# Altium schematic sheet 6 half bridge.SchDoc
size A4; SheetNumber: 6; SheetTotal: 6
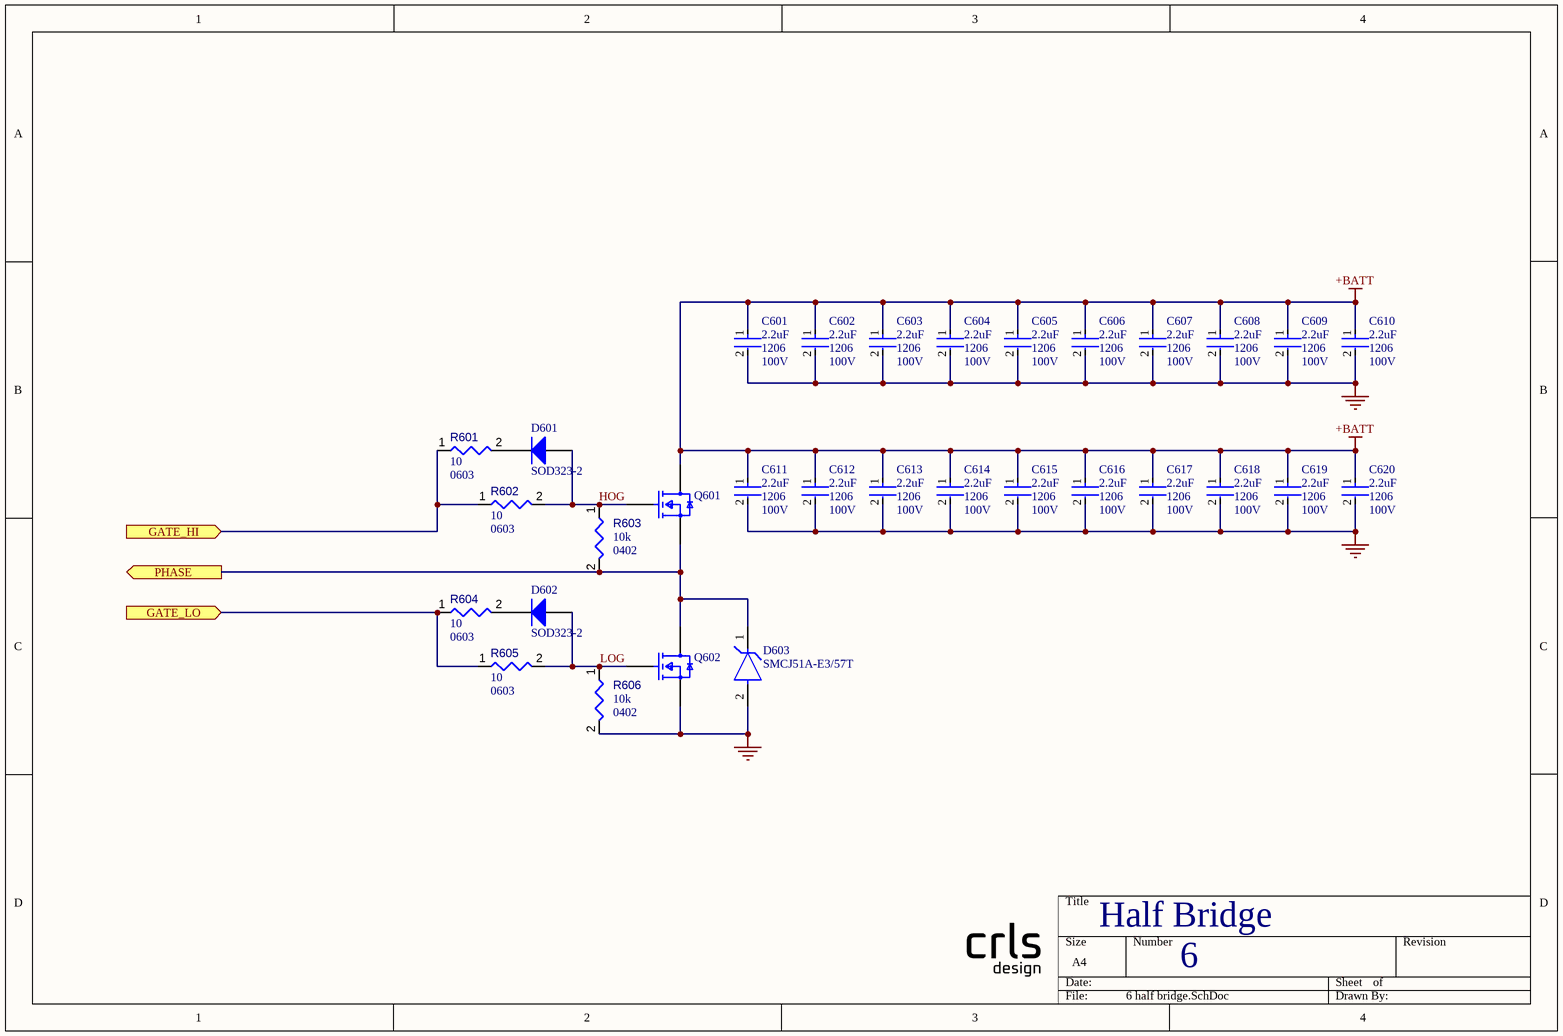
[diagram p0: 6 half bridge.SchDoc]

## Parts
C601  Voltage Rating: 100V  Case/Package: 1206  Capacitance: 2.2uF  [FP-CC1206-0_3-1_9-MFG]  (hidden comment: CC1206KKX7R0BB225)
C602  Voltage Rating: 100V  Case/Package: 1206  Capacitance: 2.2uF  [FP-CC1206-0_3-1_9-MFG]  (hidden comment: CC1206KKX7R0BB225)
C603  Voltage Rating: 100V  Case/Package: 1206  Capacitance: 2.2uF  [FP-CC1206-0_3-1_9-MFG]  (hidden comment: CC1206KKX7R0BB225)
C604  Voltage Rating: 100V  Case/Package: 1206  Capacitance: 2.2uF  [FP-CC1206-0_3-1_9-MFG]  (hidden comment: CC1206KKX7R0BB225)
C605  Voltage Rating: 100V  Case/Package: 1206  Capacitance: 2.2uF  [FP-CC1206-0_3-1_9-MFG]  (hidden comment: CC1206KKX7R0BB225)
C606  Voltage Rating: 100V  Case/Package: 1206  Capacitance: 2.2uF  [FP-CC1206-0_3-1_9-MFG]  (hidden comment: CC1206KKX7R0BB225)
C607  Voltage Rating: 100V  Case/Package: 1206  Capacitance: 2.2uF  [FP-CC1206-0_3-1_9-MFG]  (hidden comment: CC1206KKX7R0BB225)
C608  Voltage Rating: 100V  Case/Package: 1206  Capacitance: 2.2uF  [FP-CC1206-0_3-1_9-MFG]  (hidden comment: CC1206KKX7R0BB225)
C609  Voltage Rating: 100V  Case/Package: 1206  Capacitance: 2.2uF  [FP-CC1206-0_3-1_9-MFG]  (hidden comment: CC1206KKX7R0BB225)
C610  Voltage Rating: 100V  Case/Package: 1206  Capacitance: 2.2uF  [FP-CC1206-0_3-1_9-MFG]  (hidden comment: CC1206KKX7R0BB225)
C611  Voltage Rating: 100V  Case/Package: 1206  Capacitance: 2.2uF  [FP-CC1206-0_3-1_9-MFG]  (hidden comment: CC1206KKX7R0BB225)
C612  Voltage Rating: 100V  Case/Package: 1206  Capacitance: 2.2uF  [FP-CC1206-0_3-1_9-MFG]  (hidden comment: CC1206KKX7R0BB225)
C613  Voltage Rating: 100V  Case/Package: 1206  Capacitance: 2.2uF  [FP-CC1206-0_3-1_9-MFG]  (hidden comment: CC1206KKX7R0BB225)
C614  Voltage Rating: 100V  Case/Package: 1206  Capacitance: 2.2uF  [FP-CC1206-0_3-1_9-MFG]  (hidden comment: CC1206KKX7R0BB225)
C615  Voltage Rating: 100V  Case/Package: 1206  Capacitance: 2.2uF  [FP-CC1206-0_3-1_9-MFG]  (hidden comment: CC1206KKX7R0BB225)
C616  Voltage Rating: 100V  Case/Package: 1206  Capacitance: 2.2uF  [FP-CC1206-0_3-1_9-MFG]  (hidden comment: CC1206KKX7R0BB225)
C617  Voltage Rating: 100V  Case/Package: 1206  Capacitance: 2.2uF  [FP-CC1206-0_3-1_9-MFG]  (hidden comment: CC1206KKX7R0BB225)
C618  Voltage Rating: 100V  Case/Package: 1206  Capacitance: 2.2uF  [FP-CC1206-0_3-1_9-MFG]  (hidden comment: CC1206KKX7R0BB225)
C619  Voltage Rating: 100V  Case/Package: 1206  Capacitance: 2.2uF  [FP-CC1206-0_3-1_9-MFG]  (hidden comment: CC1206KKX7R0BB225)
C620  Voltage Rating: 100V  Case/Package: 1206  Capacitance: 2.2uF  [FP-CC1206-0_3-1_9-MFG]  (hidden comment: CC1206KKX7R0BB225)
D601  PackageReference: SOD323-2  [DIOD-SOD323-2-A_V]  (hidden comment: 1N4148WS-7-F)
D602  PackageReference: SOD323-2  [DIOD-SOD323-2-A_V]  (hidden comment: 1N4148WS-7-F)
D603  SMCJ51A-E3/57T  [FP-95402-MFG]
Q601  IAUT300N10S5N015ATMA1  [FP-PG-HSOF-8-MFG]  (value not drawn)
Q602  IAUT300N10S5N015ATMA1  [FP-PG-HSOF-8-MFG]  (value not drawn)
R601  value 10  Case/Package: 0603  [RESC0603(1608)_L]  (hidden comment: Resistors,0603,1%,10)
R602  value 10  Case/Package: 0603  [RESC0603(1608)_L]  (hidden comment: Resistors,0603,1%,10)
R603  value 10k  Case/Package: 0402  [RESC0402(1005)_L]  (hidden comment: Resistors,0402,1%,10k)
R604  value 10  Case/Package: 0603  [RESC0603(1608)_L]  (hidden comment: Resistors,0603,1%,10)
R605  value 10  Case/Package: 0603  [RESC0603(1608)_L]  (hidden comment: Resistors,0603,1%,10)
R606  value 10k  Case/Package: 0402  [RESC0402(1005)_L]  (hidden comment: Resistors,0402,1%,10k)

## Ports
GATE_HI (in), GATE_LO (in), PHASE (out)

## Nets
+BATT: C601.1 C602.1 C603.1 C604.1 C605.1 C606.1 C607.1 C608.1 C609.1 C610.1 C611.1 C612.1 C613.1 C614.1 C615.1 C616.1 C617.1 C618.1 C619.1 C620.1 Q601.9(DRAIN)
GND: C601.2 C602.2 C603.2 C604.2 C605.2 C606.2 C607.2 C608.2 C609.2 C610.2 C611.2 C612.2 C613.2 C614.2 C615.2 C616.2 C617.2 C618.2 C619.2 C620.2 D603.2(A) Q602.2-3-4-5-6-7-8(SOURCE) R606.2
GATE_HI: R601.1 R602.1 ; port GATE_HI
GATE_LO: R604.1 R605.1 ; port GATE_LO
HOG: D601.1(A) Q601.1(GATE) R602.2 R603.1
LOG: D602.1(A) Q602.1(GATE) R605.2 R606.1
PHASE: D603.1(C) Q601.2-3-4-5-6-7-8(SOURCE) Q602.9(DRAIN) R603.2 ; port PHASE
NetD601_2: D601.2(K) R601.2
NetD602_2: D602.2(K) R604.2

## Notes on the sheet
- Half Bridge

## Library data of the parts
C601-C620 = CMP-03422-001455-1: CAP CER 2.2UF 100V X7R 1206; Tolerance: 10%; Mount: Surface Mount; Packaging: Tape and Reel; Length: 0.126inch; Max Operating Temperature: 125°C; Min Operating Temperature: -55°C; Width: 0.063inch; Thickness: 0.057inch
D601 D602 = CMP-1667-00004-1: Fast Switching Diode, 75 V, 0.3 A, -65 to 150 degC, 2-Pin SOD323, RoHS, Tape and Reel; DatasheetVersion: Rev. 25-2, 03/2016; PackageDescription: 2-Pin Small Outline Diode, Body 1.7 x 1.3 mm; ComponentLink2Description: Datasheet; ComponentLink1URL: http://www.diodes.com/; ComponentLink2URL: http://www.diodes.com/datasheets/ds30097.pdf; ComponentLink1Description: Manufacturer URL
D603 = CMP-02577-000006-1: TVS DIODE 51V 82.4V DO214AB; Manufacturer: Vishay; Peak Pulse Power: 1500W; Breakdown Voltage: 56.7V; Standoff Height: 0mm; Direction: Unidirectional; Max Junction Temp: +150°C; Peak Pulse Current: 18.2A; Number Of Channels: 1; Temperature Range High: +150°C; Category: Diode; Temperature: -55°C to +150°C; Octopart: https://octopart.com/smcj51a-e3%2F57t-vishay-39559249; Device Class L3: unset; Mouser Description: TVS Diodes - Transient Voltage Suppressors 1500W 51V Unidirect; Digikey Description: TVS DIODE 51V 82.4V DO214AB; RoHS: TRUE; Height: 2.62mm; Reverse Standoff Voltage: 51V; Lead Free: Yes; Manufacturer Part Number: SMCJ51A-E3/57T; Clamping Voltage: 82.4V; Package: 95402; ComponentLink2URL: https://www.vishay.com/docs/88394/smcj.pdf; Device Class L1: Circuit Protection; Footprint Url: https://www.vishay.com/docs/95402/smc.pdf; Device Class L2: TVS Diodes; ComponentLink2Description: Datasheet; Automotive: No; Temperature Range Low: -55°C
Q601 Q602 = CMP-32901-000024-1: 100V 300A 1.5MOHM TOLL; Manufacturer: Infineon; Number Of Channels: 1; Power Dissipation: 375W; Automotive Grade: Grade 0; Turn Off Delay Time: 70ns; Input Capacitace At Vds: 12316pF @ 50V; Turn On Delay Time: 29ns; Max Junction Temp: +175°C; Max Forward Diode Voltage: 1.3V; Depletion Mode: False; Gate Charge At Vgs: 166nC @ 10V; Gate To Source Voltage: 20V; Typ Forward Diode Voltage: 0.9V; Reverse Recovery Charge: 220nC; Threshold Vgs Min: 2.2V; Pulse Drain Current: 1200A; Threshold Vgs Max: 3.8V; Drain To Source Resistance: 1.3mΩ; Reverse Recovery Time: 90ns; Drain To Source Voltage: 100V; Package: PG-HSOF-8; Lead Free: Yes; Temperature Range Low: -55°C; ComponentLink2URL: https://www.infineon.com/dgdl/Infineon-IAUT300N10S5N015-DS-v01_00-EN.pdf?fileId=5546d4625ee5d4cd015f2469d7203245; Category: Trans; Automotive: Yes; ComponentLink2Description: Datasheet; Height: 2.4mm; Device Class L1: Discrete Semiconductors; Temperature: -55°C to +175°C; Temperature Range High: +175°C; Number Of N Channels: 1; Digikey Description: 100V 300A 1.5MOHM TOLL; Drain To Source Breakdown Voltage: 100V; Octopart: https://octopart.com/iaut300n10s5n015atma1-infineon-88797377; Device Class L3: MOSFETs; Footprint Url: https://www.infineon.com/cms/en/product/packages/PG-HSOF/PG-HSOF-8-1/; Manufacturer Part Number: IAUT300N10S5N015ATMA1; Continuous Drain Current: 300A; RoHS: TRUE; Device Class L2: Transistors
R601-R606 = Resistors: Resistor; Tolerance: 1%; Component Type: Resistors